# Altium schematic sheet Ultrasonics.SchDoc
size D; DrawnBy: Ross Harvey; Revision: A; SheetNumber: 7
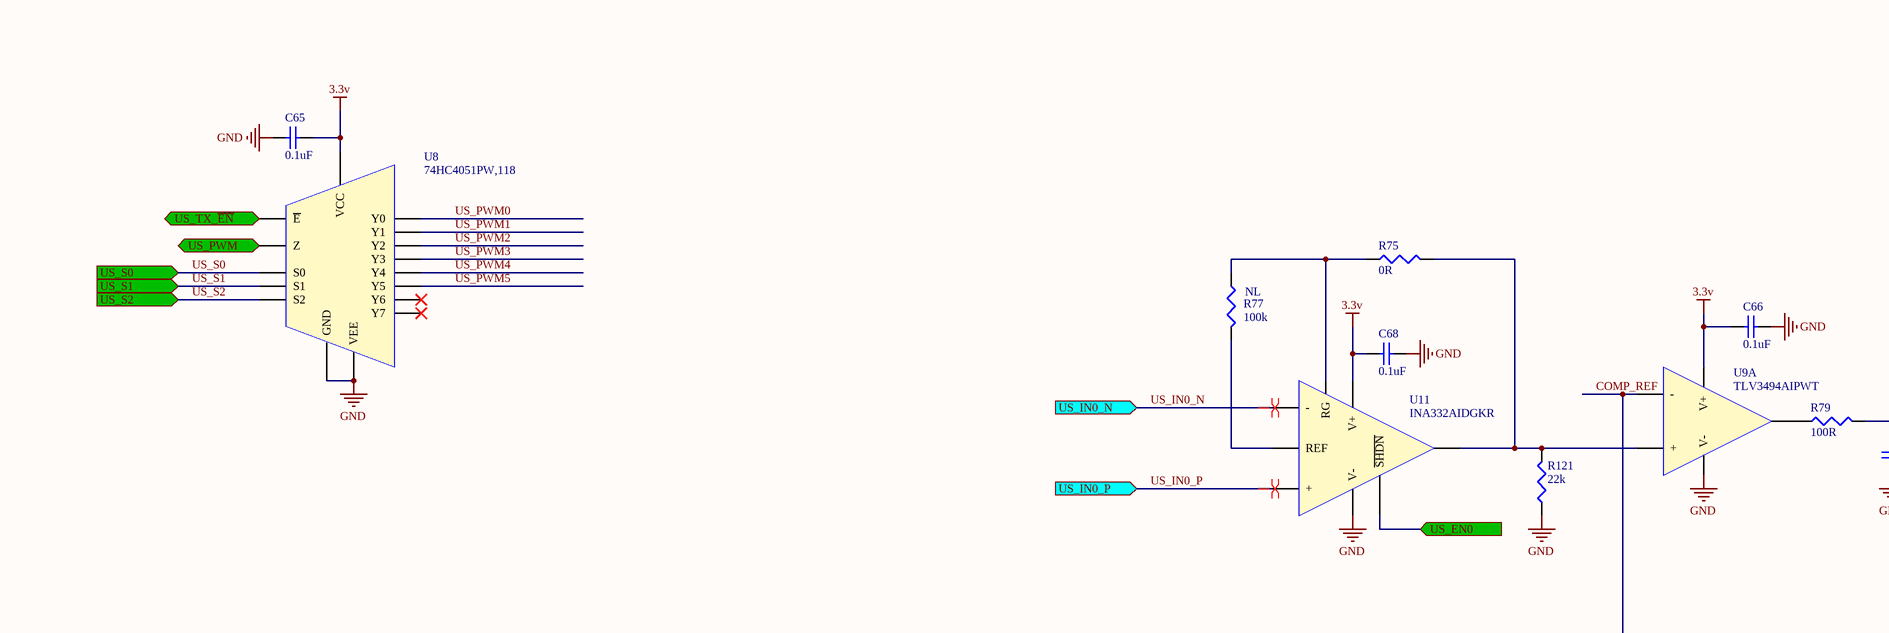
[diagram p0: Ultrasonics.SchDoc, top left]
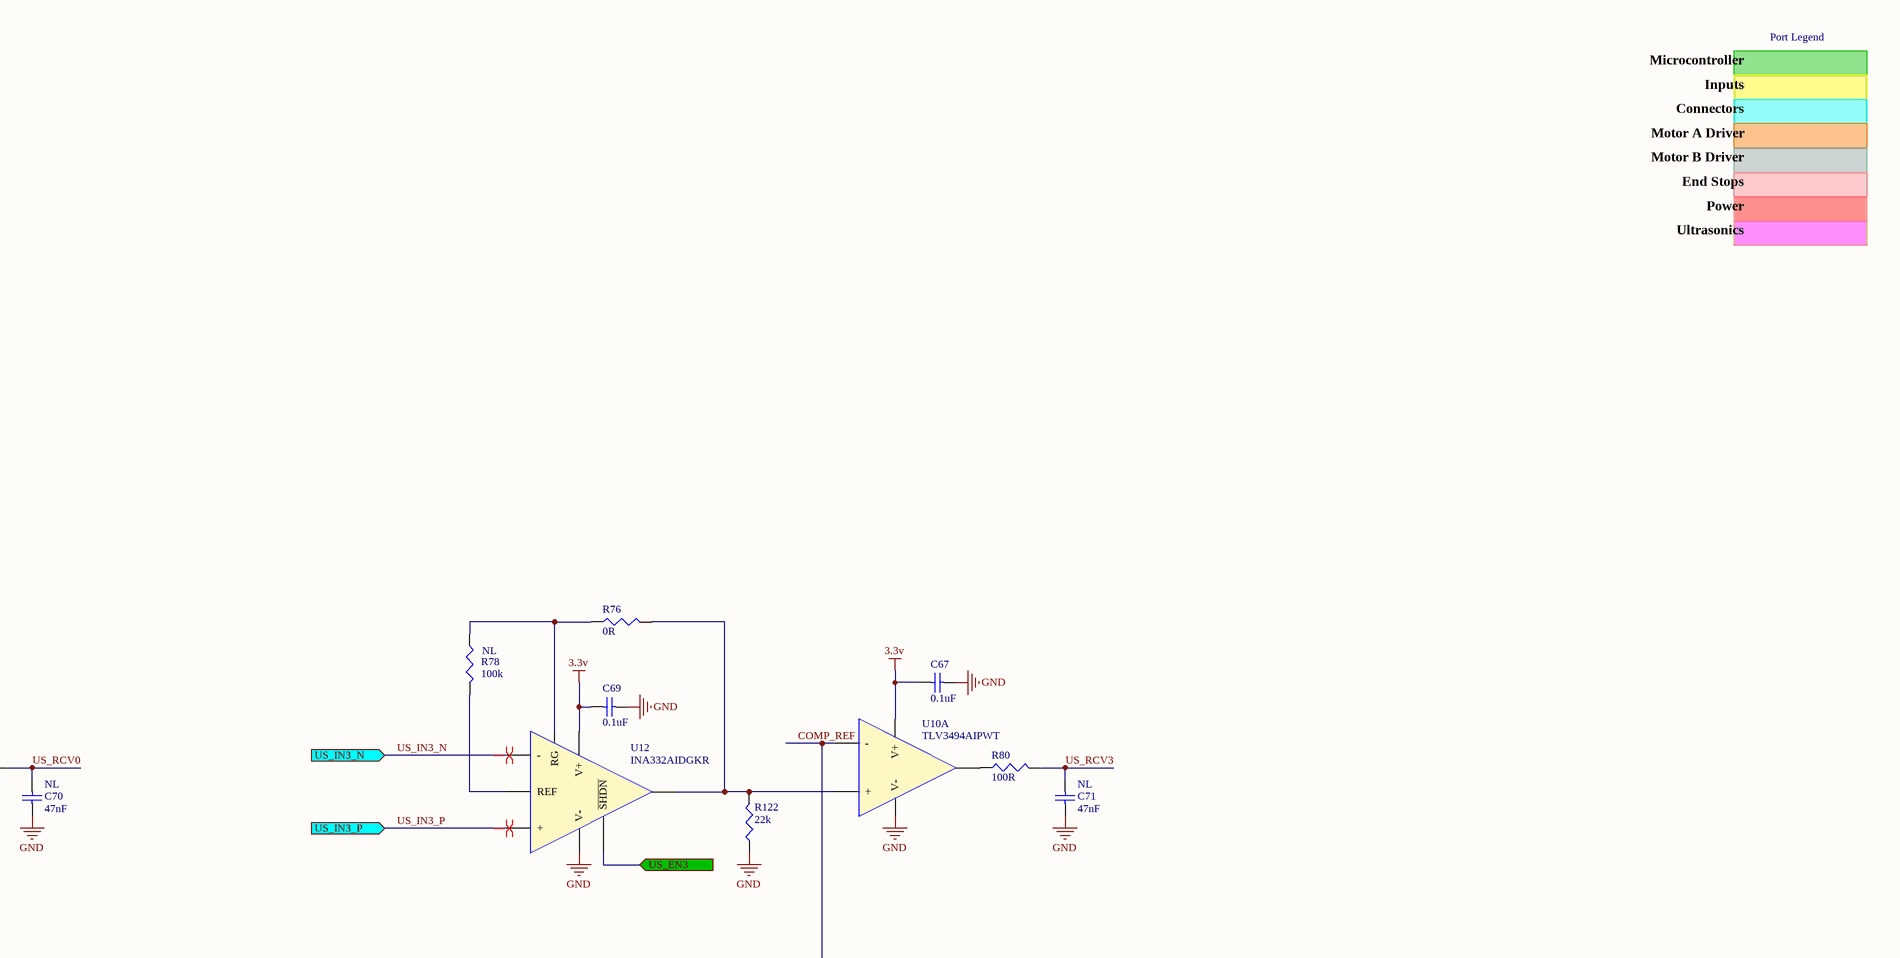
[diagram p1: Ultrasonics.SchDoc, top right]
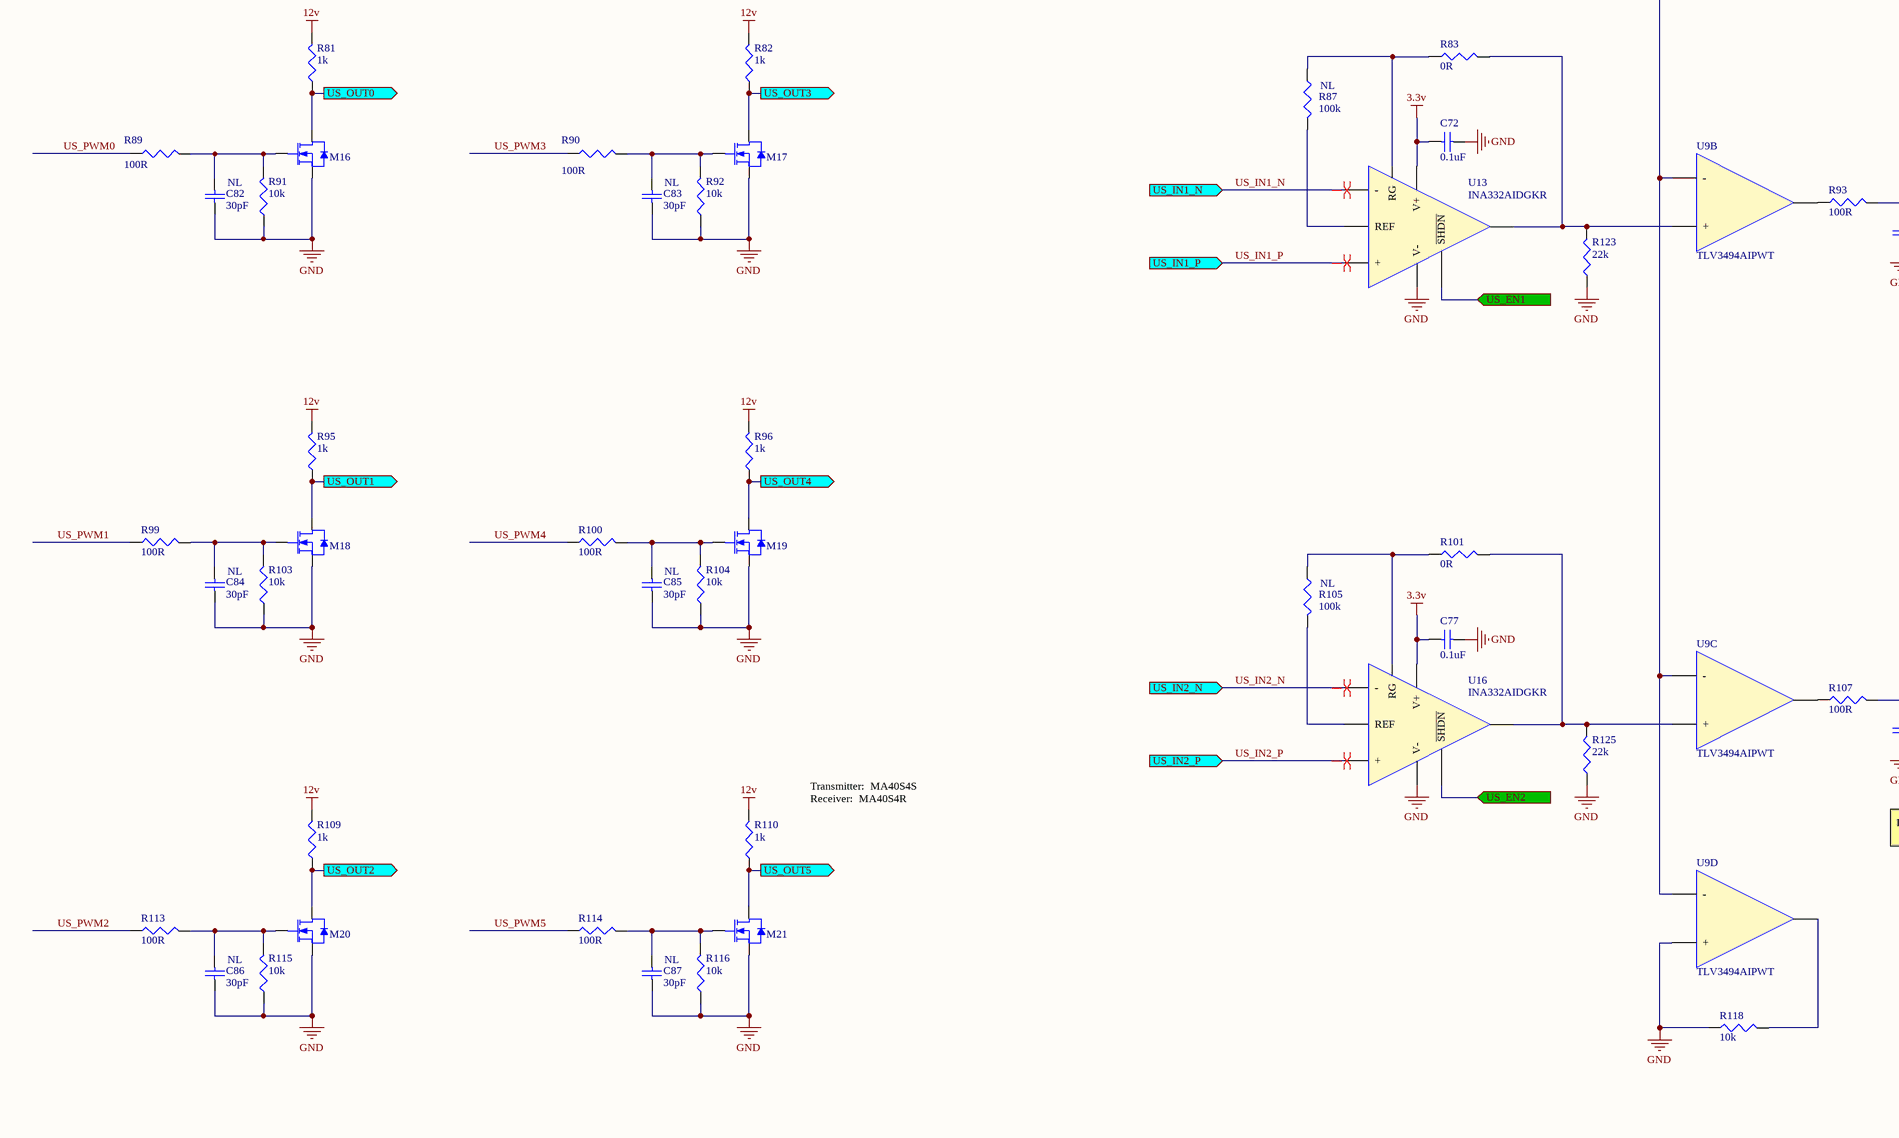
[diagram p2: Ultrasonics.SchDoc, bottom left]
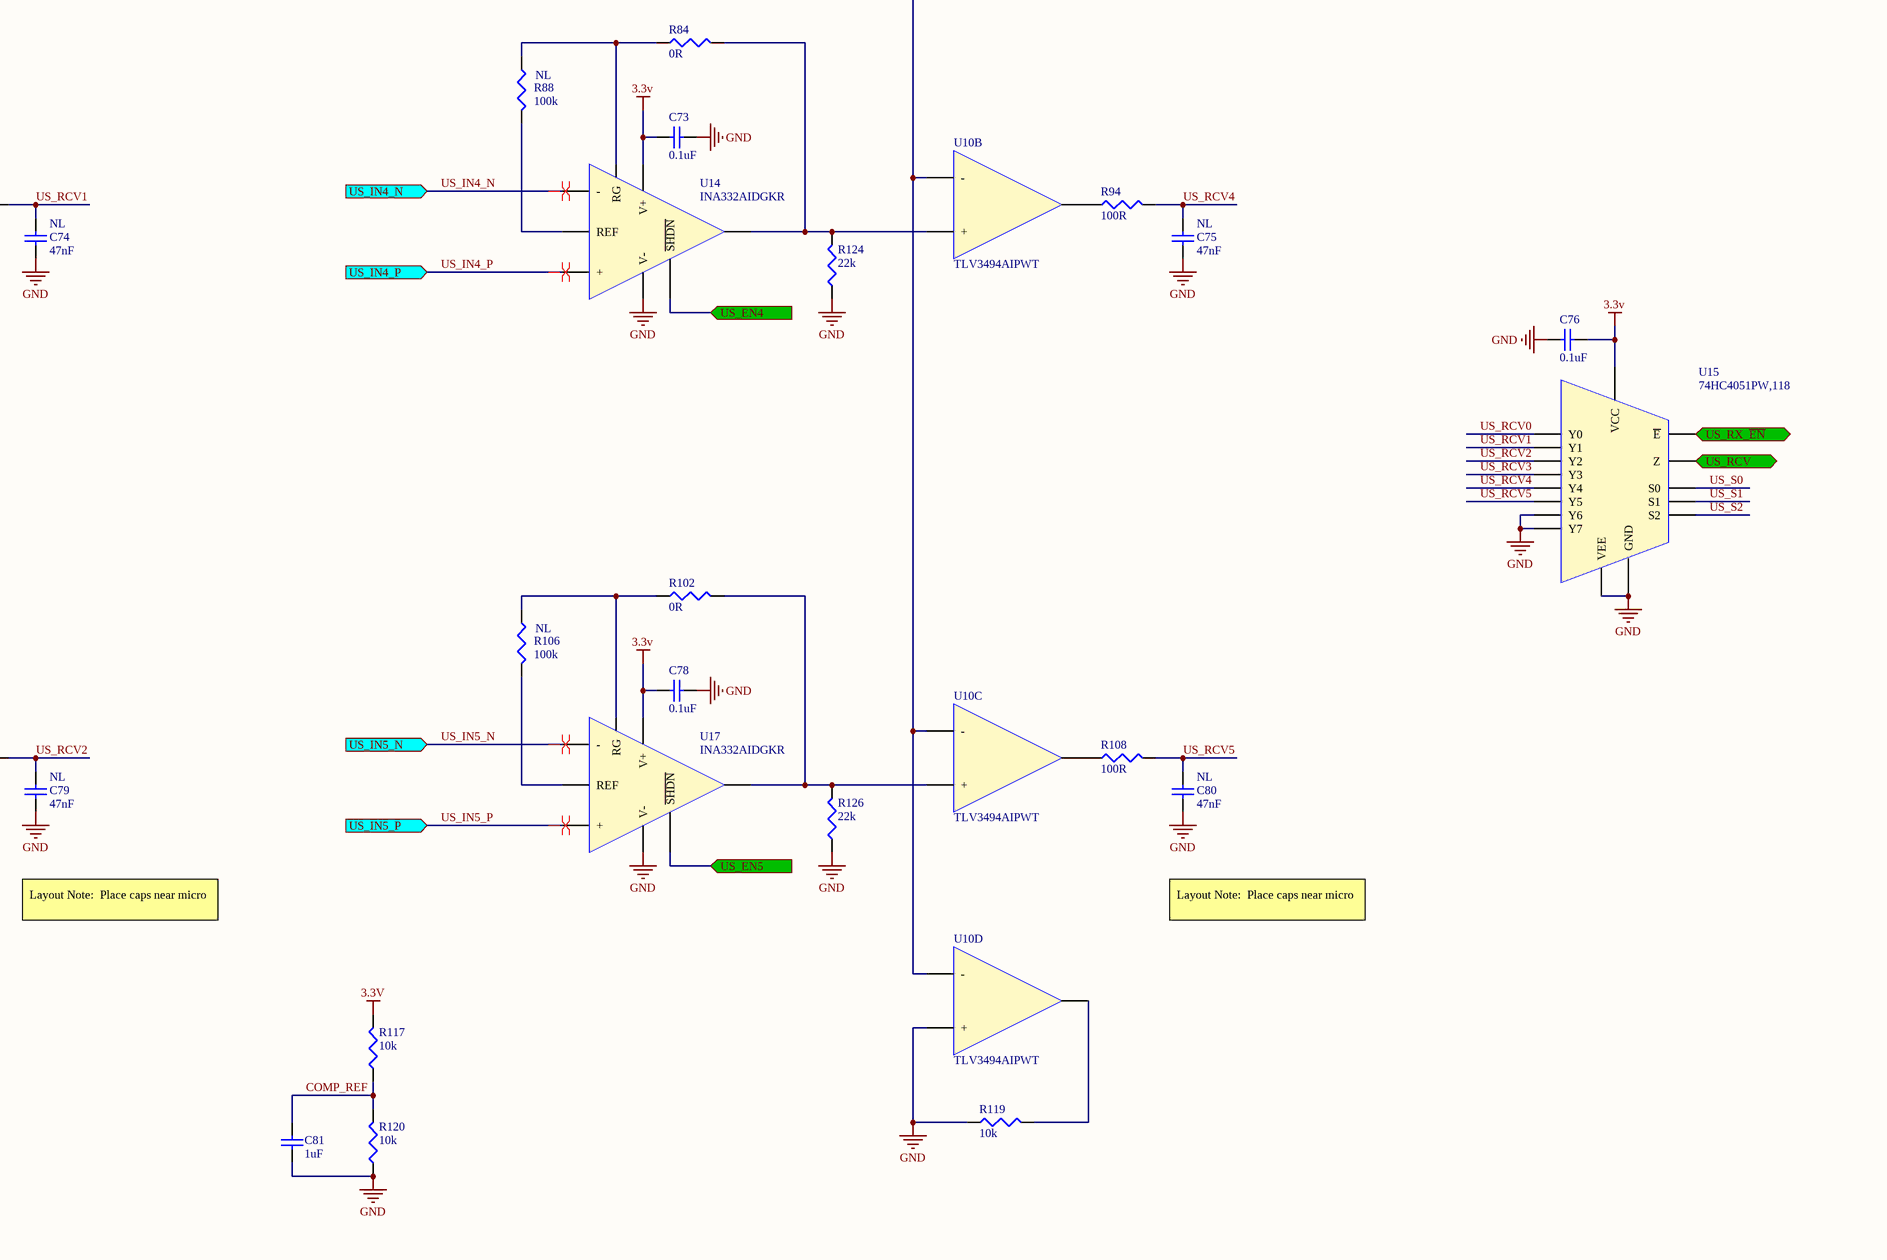
[diagram p3: Ultrasonics.SchDoc, bottom right]

## Parts
C65  0.1uF  [CAP0603W]
C66  0.1uF  [CAP0603W]
C67  0.1uF  [CAP0603W]
C68  0.1uF  [CAP0603W]
C69  0.1uF  [CAP0603W]
C70  LOAD: NL  [CAP0603W]  (hidden comment: 47nF)
C71  LOAD: NL  [CAP0603W]  (hidden comment: 47nF)
C72  0.1uF  [CAP0603W]
C73  0.1uF  [CAP0603W]
C74  LOAD: NL  [CAP0603W]  (hidden comment: 47nF)
C75  LOAD: NL  [CAP0603W]  (hidden comment: 47nF)
C76  0.1uF  [CAP0603W]
C77  0.1uF  [CAP0603W]
C78  0.1uF  [CAP0603W]
C79  LOAD: NL  [CAP0603W]  (hidden comment: 47nF)
C80  LOAD: NL  [CAP0603W]  (hidden comment: 47nF)
C81  1uF  [CAP0603W]
C82  LOAD: NL  [CAP0603W]  (hidden comment: 30pF)
C83  LOAD: NL  [CAP0603W]  (hidden comment: 30pF)
C84  LOAD: NL  [CAP0603W]  (hidden comment: 30pF)
C85  LOAD: NL  [CAP0603W]  (hidden comment: 30pF)
C86  LOAD: NL  [CAP0603W]  (hidden comment: 30pF)
C87  LOAD: NL  [CAP0603W]  (hidden comment: 30pF)
M16  Si2338DS-T1-GE3  [SOT23-3M]  (value not drawn)
M17  Si2338DS-T1-GE3  [SOT23-3M]  (value not drawn)
M18  Si2338DS-T1-GE3  [SOT23-3M]  (value not drawn)
M19  Si2338DS-T1-GE3  [SOT23-3M]  (value not drawn)
M20  Si2338DS-T1-GE3  [SOT23-3M]  (value not drawn)
M21  Si2338DS-T1-GE3  [SOT23-3M]  (value not drawn)
R75  0R  [RES0603W]
R76  0R  [RES0603W]
R77  Load: NL  [RES0603W]  (hidden comment: 100k)
R78  Load: NL  [RES0603W]  (hidden comment: 100k)
R79  100R  [RES0603W]
R80  100R  [RES0603W]
R81  1k  [RES0603W]
R82  1k  [RES0603W]
R83  0R  [RES0603W]
R84  0R  [RES0603W]
R87  Load: NL  [RES0603W]  (hidden comment: 100k)
R88  Load: NL  [RES0603W]  (hidden comment: 100k)
R89  100R  [RES0603W]
R90  100R  [RES0603W]
R91  10k  [RES0603W]
R92  10k  [RES0603W]
R93  100R  [RES0603W]
R94  100R  [RES0603W]
R95  1k  [RES0603W]
R96  1k  [RES0603W]
R99  100R  [RES0603W]
R100  100R  [RES0603W]
R101  0R  [RES0603W]
R102  0R  [RES0603W]
R103  10k  [RES0603W]
R104  10k  [RES0603W]
R105  Load: NL  [RES0603W]  (hidden comment: 100k)
R106  Load: NL  [RES0603W]  (hidden comment: 100k)
R107  100R  [RES0603W]
R108  100R  [RES0603W]
R109  1k  [RES0603W]
R110  1k  [RES0603W]
R113  100R  [RES0603W]
R114  100R  [RES0603W]
R115  10k  [RES0603W]
R116  10k  [RES0603W]
R117  10k  [RES0603W]
R118  10k  [RES0603W]
R119  10k  [RES0603W]
R120  10k  [RES0603W]
R121  22k  [RES0603W]
R122  22k  [RES0603W]
R123  22k  [RES0603W]
R124  22k  [RES0603W]
R125  22k  [RES0603W]
R126  22k  [RES0603W]
U8  74HC4051PW,118  [TSSOP16]
U9  TLV3494AIPWT  [TSSOP14]  (parts A,B,C,D of 4)
U10  TLV3494AIPWT  [TSSOP14]  (parts A,B,C,D of 4)
U11  INA332AIDGKR  [VSSOP8]
U12  INA332AIDGKR  [VSSOP8]
U13  INA332AIDGKR  [VSSOP8]
U14  INA332AIDGKR  [VSSOP8]
U15  74HC4051PW,118  [TSSOP16]
U16  INA332AIDGKR  [VSSOP8]
U17  INA332AIDGKR  [VSSOP8]

## Ports
US_EN0 (in), US_EN1 (in), US_EN2 (in), US_EN3 (in), US_EN4 (in), US_EN5 (in), US_IN0_N (in), US_IN0_P (in), US_IN1_N (in), US_IN1_P (in), US_IN2_N (in), US_IN2_P (in), US_IN3_N (in), US_IN3_P (in), US_IN4_N (in), US_IN4_P (in), US_IN5_N (in), US_IN5_P (in), US_OUT0 (out), US_OUT1 (out), US_OUT2 (out), US_OUT3 (out), US_OUT4 (out), US_OUT5 (out), US_PWM (in), US_RCV (out), US_RX_~{EN} (in), US_S0 (in), US_S1 (in), US_S2 (in), US_TX_~{EN} (in)

## Nets
3.3v: C65.2 C66.1 C67.1 C68.1 C69.1 C72.1 C73.1 C76.2 C77.1 C78.1 R117.2 U8.16(VCC) U9.4(V+) U10.4(V+) U11.7(V+) U12.7(V+) U13.7(V+) U14.7(V+) U15.16(VCC) U16.7(V+) U17.7(V+)
12v: R81.2 R82.2 R95.2 R96.2 R109.2 R110.2
GND: C65.1 C66.2 C67.2 C68.2 C69.2 C70.2 C71.2 C72.2 C73.2 C74.2 C75.2 C76.1 C77.2 C78.2 C79.2 C80.2 C81.2 C82.2 C83.2 C84.2 C85.2 C86.2 C87.2 M16.2(SOURCE) M17.2(SOURCE) M18.2(SOURCE) M19.2(SOURCE) M20.2(SOURCE) M21.2(SOURCE) R91.1 R92.1 R103.1 R104.1 R115.1 R116.1 R118.1 R119.1 R120.1 R121.1 R122.1 R123.1 R124.1 R125.1 R126.1 U8.7(VEE) U8.8(GND) U9.11(V-) U9.12(+) U10.11(V-) U10.12(+) U11.4(V-) U12.4(V-) U13.4(V-) U14.4(V-) U15.2(Y6) U15.4(Y7) U15.7(VEE) U15.8(GND) U16.4(V-) U17.4(V-)
COMP_REF: C81.1 R117.1 R120.2 U9.2(-) U9.6(-) U9.9(-) U9.13(-) U10.2(-) U10.6(-) U10.9(-) U10.13(-)
US_EN0: U11.8(~{SHDN}) ; port US_EN0
US_EN1: U13.8(~{SHDN}) ; port US_EN1
US_EN2: U16.8(~{SHDN}) ; port US_EN2
US_EN3: U12.8(~{SHDN}) ; port US_EN3
US_EN4: U14.8(~{SHDN}) ; port US_EN4
US_EN5: U17.8(~{SHDN}) ; port US_EN5
US_IN0_N: U11.2(-) ; port US_IN0_N
US_IN0_P: U11.3(+) ; port US_IN0_P
US_IN1_N: U13.2(-) ; port US_IN1_N
US_IN1_P: U13.3(+) ; port US_IN1_P
US_IN2_N: U16.2(-) ; port US_IN2_N
US_IN2_P: U16.3(+) ; port US_IN2_P
US_IN3_N: U12.2(-) ; port US_IN3_N
US_IN3_P: U12.3(+) ; port US_IN3_P
US_IN4_N: U14.2(-) ; port US_IN4_N
US_IN4_P: U14.3(+) ; port US_IN4_P
US_IN5_N: U17.2(-) ; port US_IN5_N
US_IN5_P: U17.3(+) ; port US_IN5_P
US_OUT0: M16.3(SOURCE) R81.1 ; port US_OUT0
US_OUT1: M18.3(SOURCE) R95.1 ; port US_OUT1
US_OUT2: M20.3(SOURCE) R109.1 ; port US_OUT2
US_OUT3: M17.3(SOURCE) R82.1 ; port US_OUT3
US_OUT4: M19.3(SOURCE) R96.1 ; port US_OUT4
US_OUT5: M21.3(SOURCE) R110.1 ; port US_OUT5
US_PWM: U8.3(Z) ; port US_PWM
US_PWM0: R89.1 U8.13(Y0)
US_PWM1: R99.1 U8.14(Y1)
US_PWM2: R113.1 U8.15(Y2)
US_PWM3: R90.1 U8.12(Y3)
US_PWM4: R100.1 U8.1(Y4)
US_PWM5: R114.1 U8.5(Y5)
US_RCV: U15.3(Z) ; port US_RCV
US_RCV0: C70.1 R79.2 U15.13(Y0)
US_RCV1: C74.1 R93.2 U15.14(Y1)
US_RCV2: C79.1 R107.2 U15.15(Y2)
US_RCV3: C71.1 R80.2 U15.12(Y3)
US_RCV4: C75.1 R94.2 U15.1(Y4)
US_RCV5: C80.1 R108.2 U15.5(Y5)
US_RX_~{EN}: U15.6(~{E}) ; port US_RX_~{EN}
US_S0: U8.11(S0) U15.11(S0) ; port US_S0
US_S1: U8.10(S1) U15.10(S1) ; port US_S1
US_S2: U8.9(S2) U15.9(S2) ; port US_S2
US_TX_~{EN}: U8.6(~{E}) ; port US_TX_~{EN}
NetC82_1: C82.1 M16.1(GATE) R89.2 R91.2
NetC83_1: C83.1 M17.1(GATE) R90.2 R92.2
NetC84_1: C84.1 M18.1(GATE) R99.2 R103.2
NetC85_1: C85.1 M19.1(GATE) R100.2 R104.2
NetC86_1: C86.1 M20.1(GATE) R113.2 R115.2
NetC87_1: C87.1 M21.1(GATE) R114.2 R116.2
NetR75_1: R75.1 R77.1 U11.1(RG)
NetR75_2: R75.2 R121.2 U9.3(+) U11.6(OUT)
NetR76_1: R76.1 R78.1 U12.1(RG)
NetR76_2: R76.2 R122.2 U10.3(+) U12.6(OUT)
NetR77_2: R77.2 U11.5(REF)
NetR78_2: R78.2 U12.5(REF)
NetR79_1: R79.1 U9.1(OUTA)
NetR80_1: R80.1 U10.1(OUTA)
NetR83_1: R83.1 R87.1 U13.1(RG)
NetR83_2: R83.2 R123.2 U9.5(+) U13.6(OUT)
NetR84_1: R84.1 R88.1 U14.1(RG)
NetR84_2: R84.2 R124.2 U10.5(+) U14.6(OUT)
NetR87_2: R87.2 U13.5(REF)
NetR88_2: R88.2 U14.5(REF)
NetR93_1: R93.1 U9.12(OUTB)
NetR94_1: R94.1 U10.12(OUTB)
NetR101_1: R101.1 R105.1 U16.1(RG)
NetR101_2: R101.2 R125.2 U9.10(+) U16.6(OUT)
NetR102_1: R102.1 R106.1 U17.1(RG)
NetR102_2: R102.2 R126.2 U10.10(+) U17.6(OUT)
NetR105_2: R105.2 U16.5(REF)
NetR106_2: R106.2 U17.5(REF)
NetR107_1: R107.1 U9.8(OUTC)
NetR108_1: R108.1 U10.8(OUTC)
NetR118_2: R118.2 U9.14(OUTD)
NetR119_2: R119.2 U10.14(OUTD)

Not connected (* = marked no-connect by the designer): U8 2(Y6)* 4(Y7)*

## Layout directives
differential pair: US_IN0_N, US_IN0_P, US_IN1_N, US_IN1_P, US_IN2_N, US_IN2_P, US_IN3_N, US_IN3_P, US_IN4_N, US_IN4_P, US_IN5_N, US_IN5_P

## Notes on the sheet
- Port Legend
- Microcontroller
- Inputs
- Connectors
- Motor A Driver
- Motor B Driver
- End Stops
- Power
- Ultrasonics
- Transmitter:  MA40S4S
  Receiver:  MA40S4R
- Layout Note:  Place caps near micro

## Library data of the parts
C65-C69 C72 C73 C76-C78 = 0.1uF: MFG1_PN: VJ0603Y104JXJPW1BC; MFG1: Vishay; Value: 0.1uF
C70 C71 C74 C75 C79 C80 = 47nF: MFG1_PN: VJ0603Y473JXQPW1BC; MFG1: Vishay; Value: 47nF
C81 = 1uF: MFG1_PN: VJ0805V105ZXXTW1BC; MFG1: Vishay; Value: 1uF
C82-C87 = 30pF: MFG1_PN: VJ0805A300JXBAT; MFG1: Vishay; Value: 30pF
M16-M21 = Si2338DS: NFET_SINGLE_6A_30V; LOAD: NL; MFG: VISHAY; VDS_MAX: 30v; I_MAX: 6A; VGS_MAX: 20v; P_MAX: *; RDS_ON: *; MFG_PN: Si2338DS-T1-GE3
R75 R76 R83 R84 R101 R102 = 0R (0603): MFG_PN: CRCW12060000Z0EA; MFG: Vishay; Load: NL; Value: 0R
R77 R78 R87 R88 R105 R106 = 100k (0603): Tolerance: 1%; POWER: 0.1W; MFG1_PN: CRCW0603100KFKEA; MFG1: Vishay; Value: 100k
R79 R80 R89 R90 R93 R94 R99 R100 R107 R108 R113 R114 = 100R (0603): Tolerance: 1%; POWER: 0.1W; MFG_PN: CRCW0603100RFKEA; MFG: Vishay; Load: NL; Value: 100R
R81 R82 R95 R96 R109 R110 = 1k (0603): Tolerance: 1%; POWER: 0.1W; MFG_PN: CRCW06031K00FKEA; MFG: Vishay; Load: NL; Value: 1k
R91 R92 R103 R104 R115-R120 = 10K (0603): Tolerance: 1%; POWER: 0.1W; MFG_PN: CRCW060310K0FKEA; MFG: Vishay; Load: NL; Value: 10k
R121-R126 = 22k (0603): Tolerance: 1%; POWER: 0.1W; MFG_PN: CRCW060322K0FKEA; MFG: Vishay; Load: NL; Value: 22k
U8 U15 = 74HC4051PW: 8:1 MUX/DEMUX; LOAD: NL; MFG: NXP; BANDWIDTH: 180MHz; MFG_PN: 74HC4051PW,118
U9 U10 = TLV3494AIPWT: Quad Comparator - Push-Pull Output; MFG: TI; CHANNELS: 4; LOAD: NL; VMAX: 5.5v; MFG_PN: TLV3494AIPWT
U11-U14 U16 U17 = INA332AIDGKR: Instrumentation Amplifier - 1 Channel; MFG: TI; LOAD: NL; GBP: 2MHz; VMAX: 5.5v; SINGLE_SUPPLY: TRUE; MFG_PN: INA332AIDGKR